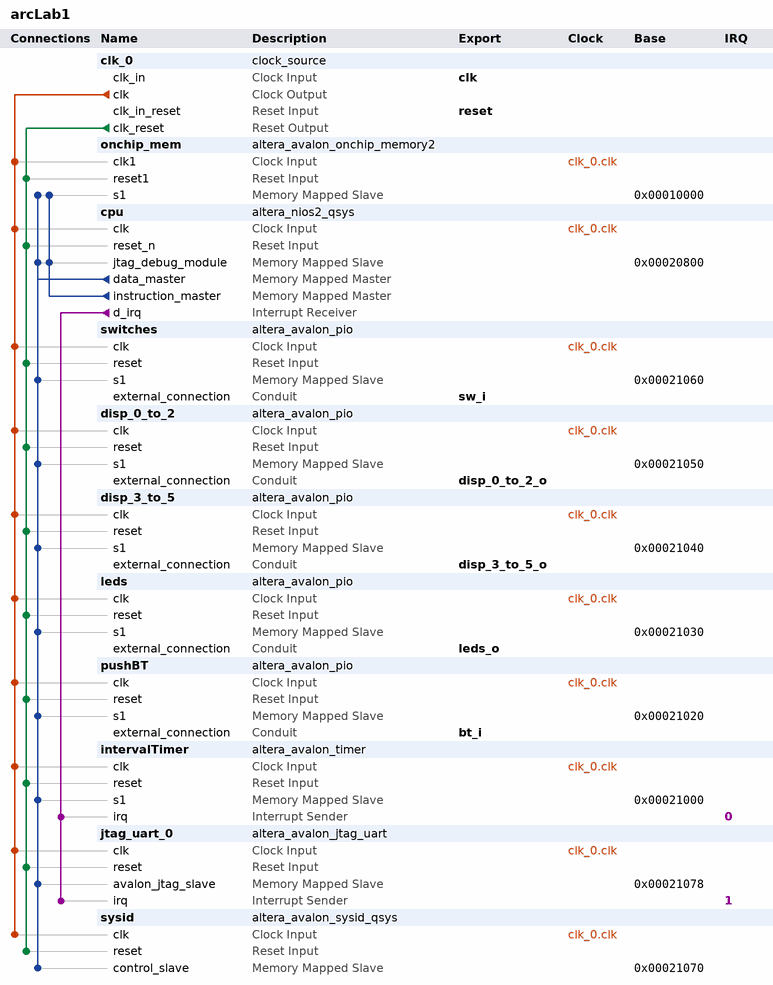
[diagram p0: system contents]
# Platform Designer (Qsys) system arcLab1, Cyclone V 5CSEMA5F31C6
# Parameters at their usual value, and those the tool derives, are not listed.
package require -exact qsys 18.1
create_system arcLab1
set_project_property DEVICE_FAMILY {Cyclone V}
set_project_property DEVICE 5CSEMA5F31C6

add_instance clk_0 clock_source 18.1
set_instance_parameter_value clk_0 clockFrequency 50000000

add_instance onchip_mem altera_avalon_onchip_memory2 18.1
set_instance_parameter_value onchip_mem dataWidth 32
set_instance_parameter_value onchip_mem dualPort false
set_instance_parameter_value onchip_mem initMemContent true
set_instance_parameter_value onchip_mem initializationFileName onchip_mem.hex
set_instance_parameter_value onchip_mem memorySize 65536

add_instance cpu altera_nios2_qsys 16.1
set_instance_parameter_value cpu breakSlave cpu.jtag_debug_module
set_instance_parameter_value cpu exceptionSlave onchip_mem.s1
set_instance_parameter_value cpu icache_size 4096
set_instance_parameter_value cpu impl Tiny
set_instance_parameter_value cpu mmu_TLBMissExcSlave None
set_instance_parameter_value cpu resetSlave onchip_mem.s1
set_instance_parameter_value cpu resetrequest_enabled true

add_instance switches altera_avalon_pio 18.1
set_instance_parameter_value switches direction Input
set_instance_parameter_value switches width 10

add_instance disp_0_to_2 altera_avalon_pio 18.1
set_instance_parameter_value disp_0_to_2 direction Output
set_instance_parameter_value disp_0_to_2 width 24

add_instance disp_3_to_5 altera_avalon_pio 18.1
set_instance_parameter_value disp_3_to_5 direction Output
set_instance_parameter_value disp_3_to_5 width 24

add_instance leds altera_avalon_pio 18.1
set_instance_parameter_value leds direction Output
set_instance_parameter_value leds width 2

add_instance pushBT altera_avalon_pio 18.1
set_instance_parameter_value pushBT captureEdge true
set_instance_parameter_value pushBT direction Input
set_instance_parameter_value pushBT edgeType FALLING
set_instance_parameter_value pushBT width 4

add_instance intervalTimer altera_avalon_timer 18.1
set_instance_parameter_value intervalTimer period 1
set_instance_parameter_value intervalTimer periodUnits MSEC

add_instance jtag_uart_0 altera_avalon_jtag_uart 18.1
set_instance_parameter_value jtag_uart_0 simInteractiveOptions NO_INTERACTIVE_WINDOWS

add_instance sysid altera_avalon_sysid_qsys 18.1
set_instance_parameter_value sysid id 105

# connections
add_connection clk_0.clk cpu.clk clock
add_connection clk_0.clk disp_0_to_2.clk clock
add_connection clk_0.clk disp_3_to_5.clk clock
add_connection clk_0.clk intervalTimer.clk clock
add_connection clk_0.clk jtag_uart_0.clk clock
add_connection clk_0.clk leds.clk clock
add_connection clk_0.clk onchip_mem.clk1 clock
add_connection clk_0.clk pushBT.clk clock
add_connection clk_0.clk switches.clk clock
add_connection clk_0.clk sysid.clk clock
add_connection clk_0.clk_reset cpu.reset_n reset
add_connection clk_0.clk_reset disp_0_to_2.reset reset
add_connection clk_0.clk_reset disp_3_to_5.reset reset
add_connection clk_0.clk_reset intervalTimer.reset reset
add_connection clk_0.clk_reset jtag_uart_0.reset reset
add_connection clk_0.clk_reset leds.reset reset
add_connection clk_0.clk_reset onchip_mem.reset1 reset
add_connection clk_0.clk_reset pushBT.reset reset
add_connection clk_0.clk_reset switches.reset reset
add_connection clk_0.clk_reset sysid.reset reset
add_connection cpu.data_master cpu.jtag_debug_module avalon
set_connection_parameter_value cpu.data_master/cpu.jtag_debug_module baseAddress 0x00020800
add_connection cpu.data_master disp_0_to_2.s1 avalon
set_connection_parameter_value cpu.data_master/disp_0_to_2.s1 baseAddress 0x00021050
add_connection cpu.data_master disp_3_to_5.s1 avalon
set_connection_parameter_value cpu.data_master/disp_3_to_5.s1 baseAddress 0x00021040
add_connection cpu.data_master intervalTimer.s1 avalon
set_connection_parameter_value cpu.data_master/intervalTimer.s1 baseAddress 0x00021000
add_connection cpu.data_master jtag_uart_0.avalon_jtag_slave avalon
set_connection_parameter_value cpu.data_master/jtag_uart_0.avalon_jtag_slave baseAddress 0x00021078
add_connection cpu.data_master leds.s1 avalon
set_connection_parameter_value cpu.data_master/leds.s1 baseAddress 0x00021030
add_connection cpu.data_master onchip_mem.s1 avalon
set_connection_parameter_value cpu.data_master/onchip_mem.s1 baseAddress 0x00010000
add_connection cpu.data_master pushBT.s1 avalon
set_connection_parameter_value cpu.data_master/pushBT.s1 baseAddress 0x00021020
add_connection cpu.data_master switches.s1 avalon
set_connection_parameter_value cpu.data_master/switches.s1 baseAddress 0x00021060
add_connection cpu.data_master sysid.control_slave avalon
set_connection_parameter_value cpu.data_master/sysid.control_slave baseAddress 0x00021070
add_connection cpu.instruction_master cpu.jtag_debug_module avalon
set_connection_parameter_value cpu.instruction_master/cpu.jtag_debug_module baseAddress 0x00020800
add_connection cpu.instruction_master onchip_mem.s1 avalon
set_connection_parameter_value cpu.instruction_master/onchip_mem.s1 baseAddress 0x00010000
add_connection cpu.d_irq intervalTimer.irq interrupt
set_connection_parameter_value cpu.d_irq/intervalTimer.irq irqNumber 0
add_connection cpu.d_irq jtag_uart_0.irq interrupt
set_connection_parameter_value cpu.d_irq/jtag_uart_0.irq irqNumber 1

# exported interfaces
add_interface bt_i conduit end
set_interface_property bt_i EXPORT_OF pushBT.external_connection
add_interface clk clock sink
set_interface_property clk EXPORT_OF clk_0.clk_in
add_interface disp_0_to_2_o conduit end
set_interface_property disp_0_to_2_o EXPORT_OF disp_0_to_2.external_connection
add_interface disp_3_to_5_o conduit end
set_interface_property disp_3_to_5_o EXPORT_OF disp_3_to_5.external_connection
add_interface leds_o conduit end
set_interface_property leds_o EXPORT_OF leds.external_connection
add_interface reset reset sink
set_interface_property reset EXPORT_OF clk_0.clk_in_reset
add_interface sw_i conduit end
set_interface_property sw_i EXPORT_OF switches.external_connection

set_interconnect_requirement {$system} qsys_mm.clockCrossingAdapter HANDSHAKE
set_interconnect_requirement {$system} qsys_mm.enableEccProtection FALSE
set_interconnect_requirement {$system} qsys_mm.insertDefaultSlave FALSE
set_interconnect_requirement {$system} qsys_mm.maxAdditionalLatency 1

save_system arcLab1.qsys
